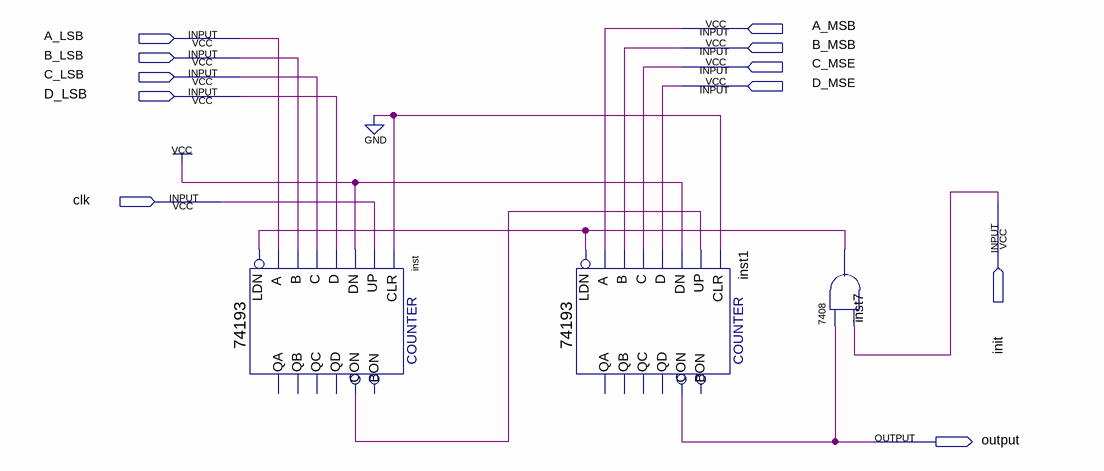
[diagram p0: schematic sheet]
// Quartus schematic labb1.bdf as structural Verilog: 3 symbols, 11 pins
module labb1 (
  input  A_MSB,
  input  A_LSB,
  input  B_MSB,
  input  B_LSB,
  input  C_MSE,
  input  C_LSB,
  input  D_MSE,
  input  D_LSB,
  input  clk,
  input  init,
  output \output 
);

  wire inst7_1, inst_con;

  \74193  inst (
    .D(D_LSB), .C(C_LSB), .B(B_LSB), .A(A_LSB), .CLR(1'b0), .UP(clk), .DN(1'b1), .LDN(inst7_1), .CON(inst_con));  // open: QB, QA, QD, QC, BON
  \74193  inst1 (
    .D(D_MSE), .C(C_MSE), .B(B_MSB), .A(A_MSB), .CLR(1'b0), .UP(inst_con), .DN(1'b1), .LDN(inst7_1),
    .CON(\output ));  // open: QB, QA, QD, QC, BON
  \7408  inst7 (.\3 (init), .\2 (\output ), .\1 (inst7_1));
endmodule
